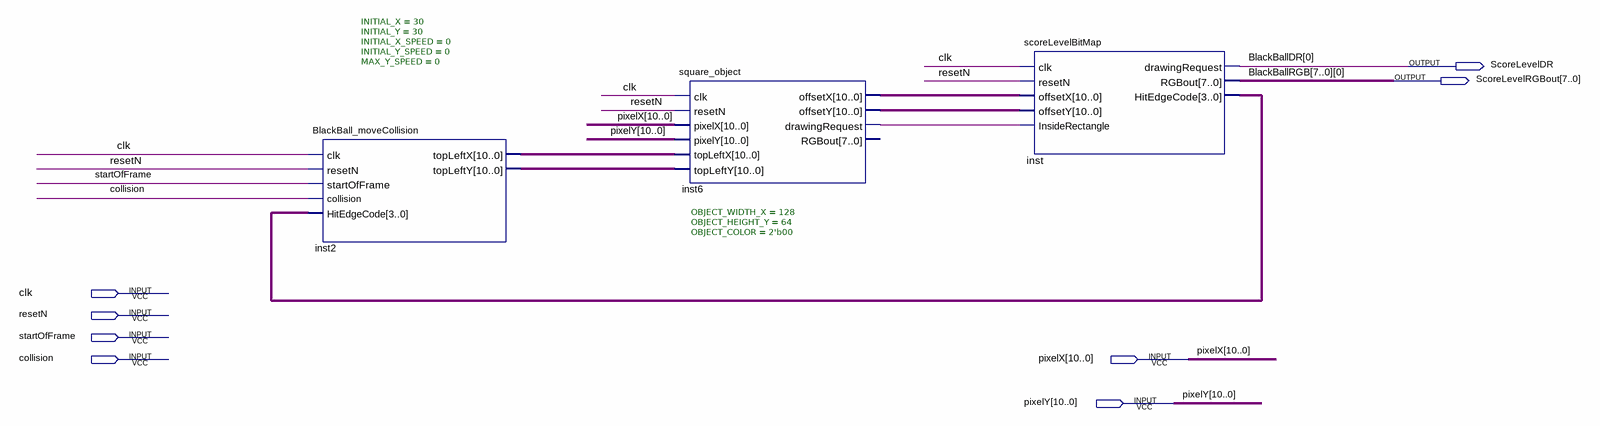
[diagram p0: schematic sheet]
// Quartus schematic ScoreLevelBlock.bdf as structural Verilog: 3 symbols, 8 pins
module ScoreLevelBlock (
  input  clk,
  input  resetN,
  input  startOfFrame,
  input  collision,
  input  [10:0] pixelX,
  input  [10:0] pixelY,
  output ScoreLevelDR,
  output [7:0] ScoreLevelRGBout
);

  wire inst6_drawingrequest;
  wire [3:0] inst_hitedgecode;
  wire [10:0] inst2_topleftx, inst2_toplefty, inst6_offsetx, inst6_offsety;

  BlackBall_moveCollision #(.INITIAL_X(30), .INITIAL_Y(30), .INITIAL_X_SPEED(0), .INITIAL_Y_SPEED(0), .MAX_Y_SPEED(0)) inst2 (
    .clk(clk), .resetN(resetN), .startOfFrame(startOfFrame), .collision(collision),
    .HitEdgeCode(inst_hitedgecode), .topLeftX(inst2_topleftx), .topLeftY(inst2_toplefty));
  square_object #(.OBJECT_WIDTH_X(128), .OBJECT_HEIGHT_Y(64), .OBJECT_COLOR(2'b00)) inst6 (
    .clk(clk), .resetN(resetN), .pixelX(pixelX), .pixelY(pixelY), .topLeftX(inst2_topleftx),
    .topLeftY(inst2_toplefty), .offsetX(inst6_offsetx), .offsetY(inst6_offsety),
    .drawingRequest(inst6_drawingrequest));  // open: RGBout
  scoreLevelBitMap inst (
    .clk(clk), .resetN(resetN), .offsetX(inst6_offsetx), .offsetY(inst6_offsety),
    .InsideRectangle(inst6_drawingrequest), .drawingRequest(ScoreLevelDR), .RGBout(ScoreLevelRGBout),
    .HitEdgeCode(inst_hitedgecode));

  // Other names for the same wires on the sheet: BlackBallDR[0] = ScoreLevelDR;
  //   BlackBallRGB_0[0] = ScoreLevelRGBout[0]; BlackBallRGB_1[0] = ScoreLevelRGBout[1];
  //   BlackBallRGB_2[0] = ScoreLevelRGBout[2]; BlackBallRGB_3[0] = ScoreLevelRGBout[3];
  //   BlackBallRGB_4[0] = ScoreLevelRGBout[4]; BlackBallRGB_5[0] = ScoreLevelRGBout[5];
  //   BlackBallRGB_6[0] = ScoreLevelRGBout[6]; BlackBallRGB_7[0] = ScoreLevelRGBout[7]
endmodule
